# EAGLE design ATtinyMario schematic_fullboard (EAGLE 9.5.0)
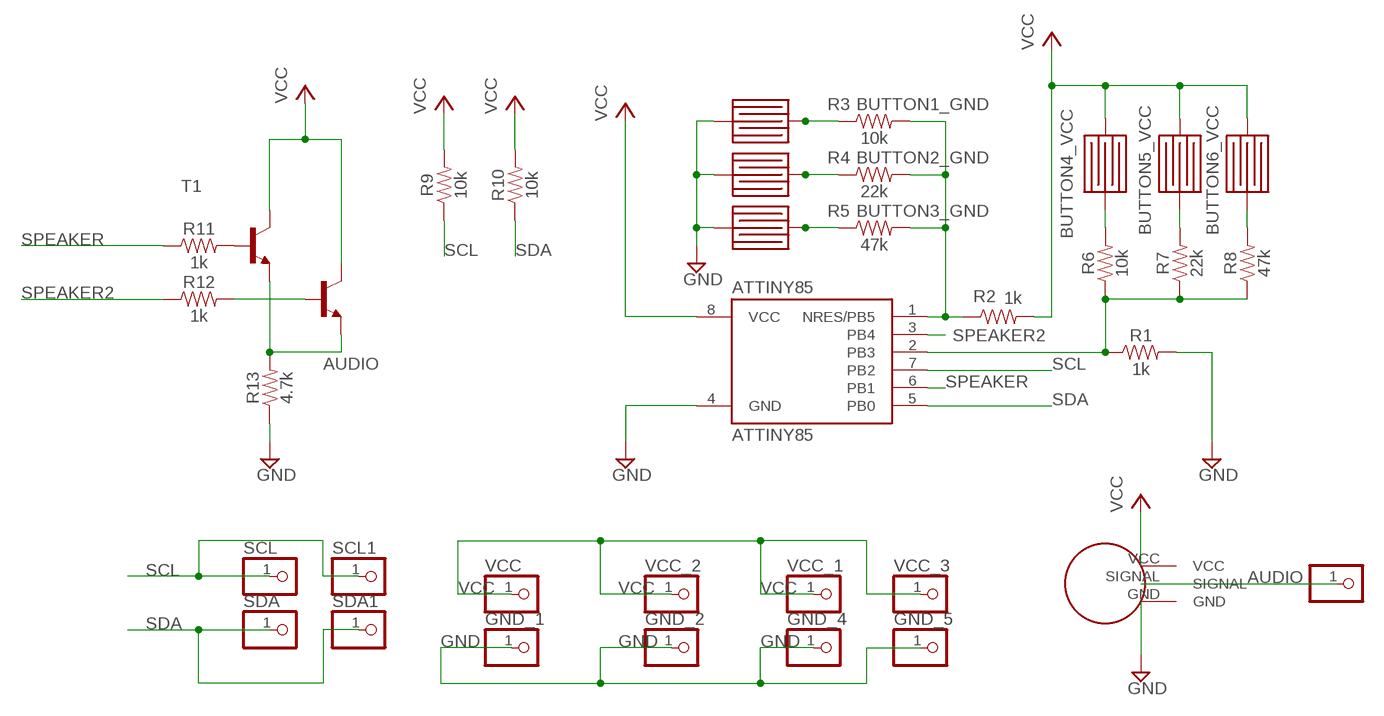
[diagram p0: schematic, sheet 1]

## Parts
ATTINY85  ATTINY85  ATTINY85-20P  [PDIP08_300MIL]
GND_1  PINHD-1X1  [1X01]
GND_2  PINHD-1X1  [1X01]
GND_3  PINHD-1X1  [1X01]
GND_4  PINHD-1X1  [1X01]
GND_5  PINHD-1X1  [1X01]
R1  1k  RESISTORAXIAL-0.3  [AXIAL-0.3]
R2  1k  RESISTORAXIAL-0.3  [AXIAL-0.3]
R3  10k  RESISTORAXIAL-0.3  [AXIAL-0.3]
R4  22k  RESISTORAXIAL-0.3  [AXIAL-0.3]
R5  47k  RESISTORAXIAL-0.3  [AXIAL-0.3]
R6  10k  RESISTORAXIAL-0.3  [AXIAL-0.3]
R7  22k  RESISTORAXIAL-0.3  [AXIAL-0.3]
R8  47k  RESISTORAXIAL-0.3  [AXIAL-0.3]
R9  10k  RESISTORAXIAL-0.3  [AXIAL-0.3]
R10  10k  RESISTORAXIAL-0.3  [AXIAL-0.3]
R11  1k  RESISTORAXIAL-0.3  [AXIAL-0.3]
R12  1k  RESISTORAXIAL-0.3  [AXIAL-0.3]
R13  4.7k  RESISTORAXIAL-0.3  [AXIAL-0.3]
SCL  PINHD-1X1CB  [1X01-CLEANBIG]
SCL1  PINHD-1X1CB  [1X01-CLEANBIG]
SDA  PINHD-1X1CB  [1X01-CLEANBIG]
SDA1  PINHD-1X1CB  [1X01-CLEANBIG]
T1  2N2222  [TO92-EBC-OVAL]
T2  2N2222  [TO92-EBC-OVAL]
U$1  PCB_BUTTON_DEVICE  [PCB_BUTTON]
U$2  PCB_BUTTON_DEVICE  [PCB_BUTTON]
U$3  PCB_BUTTON_DEVICE  [PCB_BUTTON]
U$4  PCB_BUTTON_DEVICE  [PCB_BUTTON]
U$5  VOLUME_WHEEL  [VOLUME_PCB]
U$6  PCB_BUTTON_DEVICE  [PCB_BUTTON]
U$7  PCB_BUTTON_DEVICE  [PCB_BUTTON]
VCC  PINHD-1X1  [1X01]
VCC_1  PINHD-1X1  [1X01]
VCC_2  PINHD-1X1  [1X01]
VCC_3  PINHD-1X1  [1X01]

## Nets
AUDIO: GND_3.1 R13.P$2 T1.E T2.E U$5.SIGNAL
BUTTON1_GND: R3.P$1 U$1.PAD1
BUTTON2_GND: R4.P$1 U$6.PAD1
BUTTON3_GND: R5.P$1 U$7.PAD1
BUTTON4_VCC: R6.P$2 U$2.PAD2
BUTTON5_VCC: R7.P$2 U$3.PAD2
BUTTON6_VCC: R8.P$2 U$4.PAD2
GND: ATTINY85.4(GND) GND_1.1 GND_2.1 GND_4.1 GND_5.1 R1.P$2 R13.P$1 U$1.PAD2 U$5.GND U$6.PAD2 U$7.PAD2
N$1: ATTINY85.1(NRES/PB5) R2.P$1 R3.P$2 R4.P$2 R5.P$2
N$2: ATTINY85.2(PB3) R1.P$1 R6.P$1 R7.P$1 R8.P$1
N$3: R11.P$2 T1.B
N$4: R12.P$2 T2.B
SCL: ATTINY85.7(PB2) R9.P$1 SCL1.1 SCL.1
SDA: ATTINY85.5(PB0) R10.P$1 SDA1.1 SDA.1
SPEAKER: ATTINY85.6(PB1) R11.P$1
SPEAKER2: ATTINY85.3(PB4) R12.P$1
VCC: ATTINY85.8(VCC) R2.P$2 R9.P$2 R10.P$2 T1.C T2.C U$2.PAD1 U$3.PAD1 U$4.PAD1 U$5.VCC VCC.1 VCC_1.1 VCC_2.1 VCC_3.1

## Library data of the parts
ATTINY85 = _hhn_attiny25_45_85:ATTINY85*: ATMEL ATtiny 85 Packages: P = PDIP 08 30mil S = SOIC 08 EIAJ 208mil Technologies Note: for complete ordering code (temp. range, finish, tape&reel etc.) see www.atmel.com • Supply Voltage: V = (1.8…5.5)V | [blank] = (2.7…5.5)V • Speed: 10 = 10 MHz | 20 = 20 MHz Author: Dipl.-Ing. FH Rainer Bayer HHN Hochschule Heilbronn (Heilbronn University), rainer.bayer@hs-heilbronn.de Ingenieurbüro ing-rb, mail@ing-rb.de
GND_1-GND_5 SCL SCL1 SDA SDA1 VCC VCC_1-VCC_3 = adafruit:PINHD-1X1: Pin header 1x1 for 0.1" spacing With round pins
R1-R13 = SparkFun-Resistors:RESISTOR: Generic Resistor Package
T1 T2 = adafruit:2N2222: NPN TRANSISTOR Big oval pads
U$1-U$4 U$6 U$7 = PCB_button:PCB_BUTTON_DEVICE
U$5 = PCB_wheel:VOLUME_WHEEL

## Board
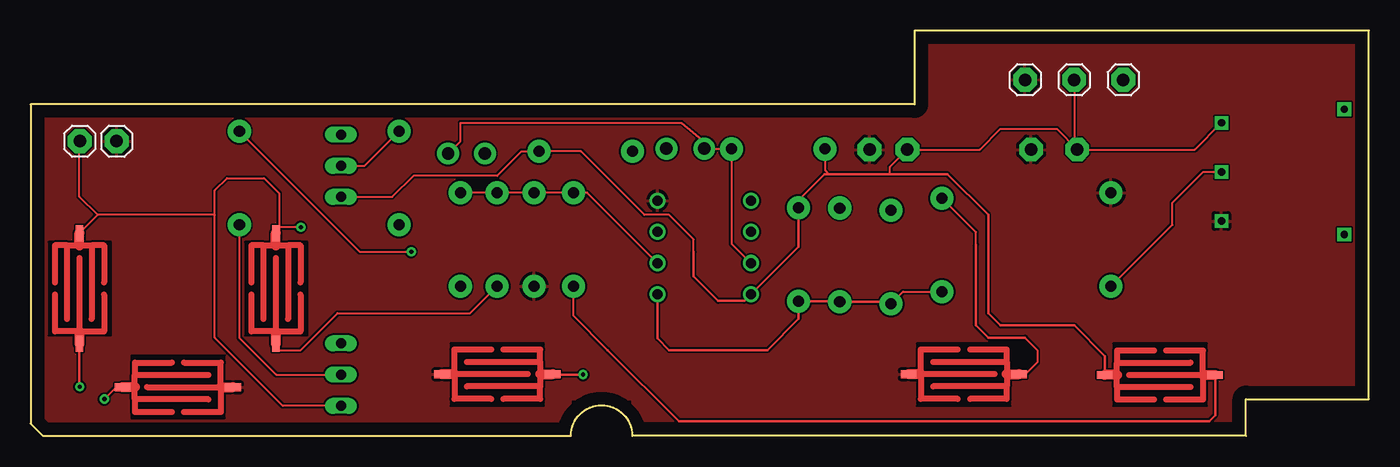
[diagram p1: board, top side]
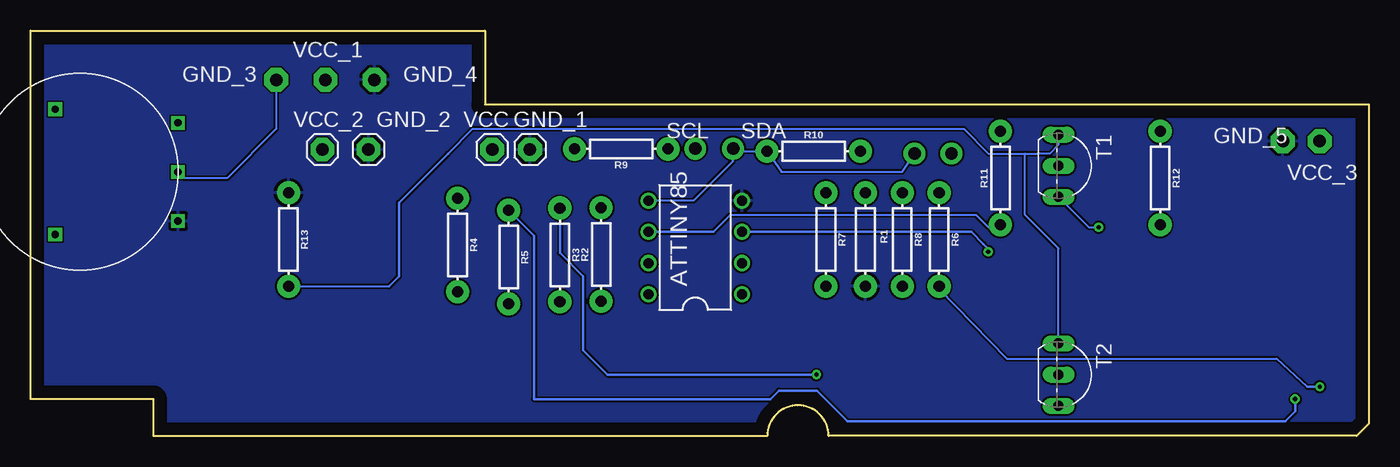
[diagram p2: board, bottom side, seen from below]

Size 109 x 33 mm. Coordinates in mm from the lower left corner, seen from the top.
Outline: 1,0 44,0 arc-180 49,0 99,0 99,3 109,3 109,33 72,33 72,27 0,27 0,1 1,0
Copper layers (1*16): Top 0.035mm / dielectric 1.5mm / Bottom 0.035mm
Design rules "default *": minimum track width 6mil, minimum drill 0.35mm, track to track 6mil, track to pad 6mil, pad to pad 6mil, via to via 6mil, smd to smd 6mil, copper to edge 40mil, drill to drill 6mil, minimum pad ring 10mil, minimum via ring 8mil, stop-mask expansion 4mil, vias tented up to drill 0mil, thermal gap 10mil

### Footprints (pad centres in the part's own frame; a part is rotated, then mirrored left to right if it is on the bottom)
PDIP08_300MIL = drill 0.813: 1 -3.81,-3.81; 2 -1.27,-3.81; 3 1.27,-3.81; 4 3.81,-3.81; 5 3.81,3.81; 6 1.27,3.81; 7 -1.27,3.81; 8 -3.81,3.81
1X01 = drill 1.016 pad 1.93 octagon: 1 0,0
AXIAL-0.3 = drill 0.9 pad 1.88: P$1 -3.81,0; P$2 3.81,0
1X01-CLEANBIG = drill 1.016 pad 1.778: 1 0,0
TO92-EBC-OVAL = drill 0.813 long: B 0,-1.27; C 2.54,-1.27; E -2.54,-1.27
PCB_BUTTON = smd 1.27 x 0.635: PAD1 4.51,0.03; PAD2 -4.49,0.03
VOLUME_PCB = drill 0.6 square: GND 0,-4; P$4 -10,-5.1; P$5 -10,5.1; SIGNAL 0,0; VCC 0,4

### Placement (x,y rotation side)
ATTINY85  54.87,15.35 90 bottom
GND_1  68.33,23.32 0 bottom
GND_2  81.49,23.32 0 bottom
GND_3  89,29 0 top
GND_4  81,29 0 top
GND_5  7,24 0 top
R1  41,16 270 bottom
R2  62.53,14.77 90 bottom
R3  65.9,14.75 270 bottom
R4  74.22,15.56 270 bottom
R5  70.06,14.56 270 bottom
R6  35,16 270 bottom
R7  44.22,16 270 bottom
R8  38,16 270 bottom
R9  60.9,23.37 180 bottom
R10  45.22,23.18 0 bottom
R11  30,21 90 bottom
R12  17,21 270 bottom
R13  88,16 270 bottom
SCL  54.87,23.4 0 bottom
SCL1  34,23 0 top
SDA  51.79,23.4 0 bottom
SDA1  37,23 0 top
T1  24,22 270 bottom
T2  24,5 270 bottom
U$1  38,5 0 top
U$2  4,12 90 top
U$3  92,5 180 top
U$4  20,12 90 top
U$5  97,21.5 0 bottom
U$6  76,5 0 top
U$7  12,4 180 top
VCC  71.41,23.32 0 bottom
VCC_1  85,29 0 top
VCC_2  85.25,23.32 0 bottom
VCC_3  4,24 0 top

### Tracks (layer width: path | path; a pad name or v marks a point on that pad's centre or on a via)
AUDIO
  Top 0.152: R13.P$2 93,17.19 93,19 95.5,21.5 U$5.SIGNAL
  Bottom 0.152: 75,23 73,25 33,25 31,23 28,23 | R13.P$2 79.81,12.19 | 28,23 27,23 26,23 25.27,23.73 T1.E | T2.E 25.27,15.27 28,18 28,23 | GND_3.1 89,25 93,21 96.5,21 U$5.SIGNAL
  Bottom 0.2: 79.81,12.19 79,13 79,19 75,23
BUTTON1_GND  (via drill 0.35)
  Top 0.2: v45,5 42.54,5 U$1.PAD1
  Bottom 0.2: R3.P$1 65.9,14.9 64,13 64,7 62,5 v45,5
BUTTON2_GND
  Top 0.152: 81,8 82,7 82,6 81.03,5.03 U$6.PAD1 | 77,15.59 77,16.59 R4.P$1
  Top 0.2: 77,15.59 77,9 78,8 81,8
BUTTON3_GND  (via drill 0.35)
  Top 0.2: v6,3 6.97,3.97 U$7.PAD1
  Bottom 0.2: R5.P$1 68,16.31 68,3 48.74,3 48.05,3.69 44.95,3.69 42.45,1.19 6.81,1.19 6,2 v6,3
BUTTON4_VCC  (via drill 0.35)
  Top 0.2: U$2.PAD2 3.97,4.03 v4,4
  Bottom 0.152: R6.P$2 35,12 29.5,6.3 7.5,6.3 5,4
  Bottom 0.2: 5,4 v4,4
BUTTON5_VCC
  Top 0.152: 47,7 44.22,9.78 R7.P$2
  Top 0.2: U$3.PAD2 96.49,1.68 96,1.19 52.81,1.19 47,7
BUTTON6_VCC
  Top 0.152: U$4.PAD2 20,7.48 20,7 22,7 25,10 35.81,10 R8.P$2
GND
  pour Top: 0,27 0,1 1,0 44,0 44,3 49,3 49,0 99,0 99,3 109,3 109,33 72,33 72,27
  pour Bottom: 0,27 0,1 1,0 44,0 44,3 49,3 49,0 99,0 99,3 109,3 109,33 72,33 72,27
N$1
  Top 0.152: R5.P$2 71.06,11.75 R4.P$2
  Top 0.2: ATTINY85.1 51.06,7.94 52,7 60,7 62.53,9.53 R2.P$1 65.88,10.96 R3.P$2 69.87,10.94 R5.P$2
N$2
  Top 0.152: ATTINY85.2 45.33,19.81 R7.P$1 R1.P$1 R8.P$1 R6.P$1
N$3
  Top 0.152: R11.P$2 27.19,22 T1.B
N$4
  Top 0.152: R12.P$2 17,8 20,5 T2.B
SCL
  Top 0.152: ATTINY85.7 57.09,15.67 R9.P$1 54.9,23.37 SCL.1 54.87,23.96 53,25.5 35,25.5 35,24 SCL1.1
SDA
  Bottom 0.152: SDA1.1 38,21.5 47.85,21.5 R10.P$1 51.57,23.18 SDA.1 51.79,22.37 55,19.16 ATTINY85.5
SPEAKER
  Bottom 0.152: 53.38,16.62 52,18 32,18 31,17 30.19,17 R11.P$1
  Bottom 0.2: ATTINY85.6 53.38,16.62
SPEAKER2  (via drill 0.35)
  Top 0.152: R12.P$1 26.81,15 v31,15
  Bottom 0.152: v31,15 31,15.24 31.38,15.62
  Bottom 0.2: ATTINY85.3 32.38,16.62 31.38,15.62
VCC  (via drill 0.35)
  Top 0.152: VCC_2.1 83.57,25 79,25 77.32,23.32 VCC.1 70,21.91 70,21.33 | VCC_2.1 94.82,23.32 U$5.VCC | R9.P$2 64.71,21.62 65,21.33 | 54,15 54,16 52,18 50,18 44.82,23.18 R10.P$2 40,23.18 38,21.18 31.18,21.18 29.46,19.46 T1.C | U$4.PAD1 20.23,16.77 20.23,17 | T2.C 20.54,2.46 15,8 15,18 | 15,18 15,20 16,21 19,21 20.23,19.77 20.23,17 | 15,18 5.46,18 | v22,17 20.23,17 | VCC_1.1 85,23.57 VCC_2.1 | VCC_3.1 3.97,23.97 3.97,19.49 5.46,18 | 5.46,18 U$2.PAD1
  Top 0.2: U$3.PAD1 87.49,6.51 85,9 79,9 78,10 78,18 74.67,21.33 70,21.33 65,21.33 64.67,21.33 62.53,19.19 R2.P$2 62.53,15.39 ATTINY85.8 58.14,11 56,11 54,13 54,15
  Bottom 0.152: T1.C 22.81,17 v22,17

### Text on the board
bValues: GND | Vcc | AUDIO | SDA | SCL | GND | Vcc | GND | Vcc | SCL | SDA | Vcc | GND